# EAGLE design Easy_LED (EAGLE 6.4)
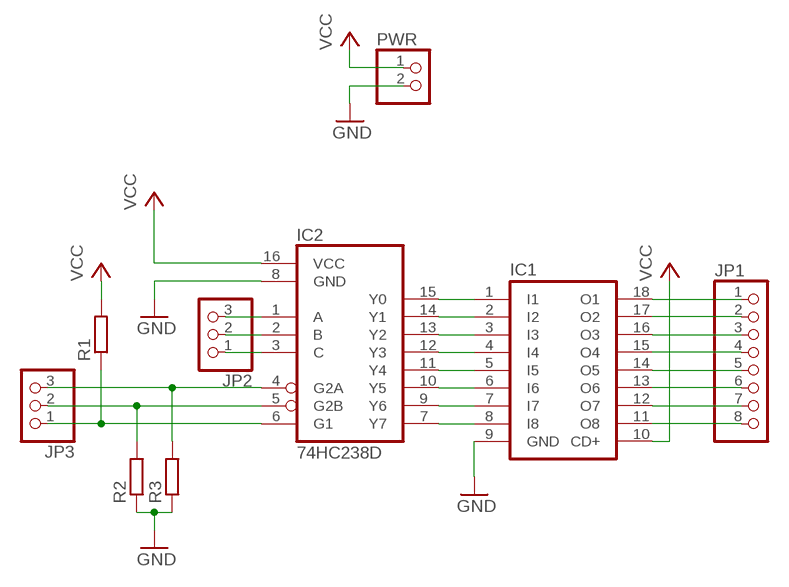
[diagram p0: schematic, sheet 1]

## Parts
IC1  ULN2803ASOP18  [SOP18]
IC2  74HC238D  [SO16]
JP1  PINHD-1X8  [1X08]
JP2  PINHD-1X3  [1X03]
JP3  PINHD-1X3  [1X03]
PWR  PINHD-1X2  [1X02]
R1  R-EU_0207/7  [0207/7]
R2  R-EU_M0805  [M0805]
R3  R-EU_M0805  [M0805]

## Nets
GND: IC1.9(GND) IC2.8(GND) PWR.2 R2.1 R3.1
N$1: IC1.17(O2) JP1.2
N$2: IC1.16(O3) JP1.3
N$3: IC1.15(O4) JP1.4
N$4: IC1.14(O5) JP1.5
N$5: IC1.13(O6) JP1.6
N$6: IC1.12(O7) JP1.7
N$7: IC1.18(O1) JP1.1
N$8: IC1.1(I1) IC2.15(Y0)
N$9: IC1.2(I2) IC2.14(Y1)
N$10: IC1.3(I3) IC2.13(Y2)
N$11: IC1.11(O8) JP1.8
N$15: IC1.4(I4) IC2.12(Y3)
N$16: IC1.5(I5) IC2.11(Y4)
N$17: IC1.6(I6) IC2.10(Y5)
N$22: IC1.7(I7) IC2.9(Y6)
N$23: IC1.8(I8) IC2.7(Y7)
N$24: IC2.1(A) JP2.3
N$29: IC2.2(B) JP2.2
N$30: IC2.3(C) JP2.1
N$31: IC2.4(G2A) JP3.3 R3.2
N$36: IC2.5(G2B) JP3.2 R2.2
N$37: IC2.6(G1) JP3.1 R1.1
VCC: IC1.10(CD+) IC2.16(VCC) PWR.1 R1.2

## Library data of the parts
IC1 = BEEP:ULN2803A: DRIVER ARRAY
IC2 = BEEP:74HC238: 3 to 8 line DECODER/DEMULTIPLEXER
JP1 = pinhead:PINHD-1X8: PIN HEADER
JP2 JP3 = pinhead:PINHD-1X3: PIN HEADER
PWR = pinhead:PINHD-1X2: PIN HEADER
R1-R3 = rcl:R-EU_: RESISTOR, European symbol

## Board
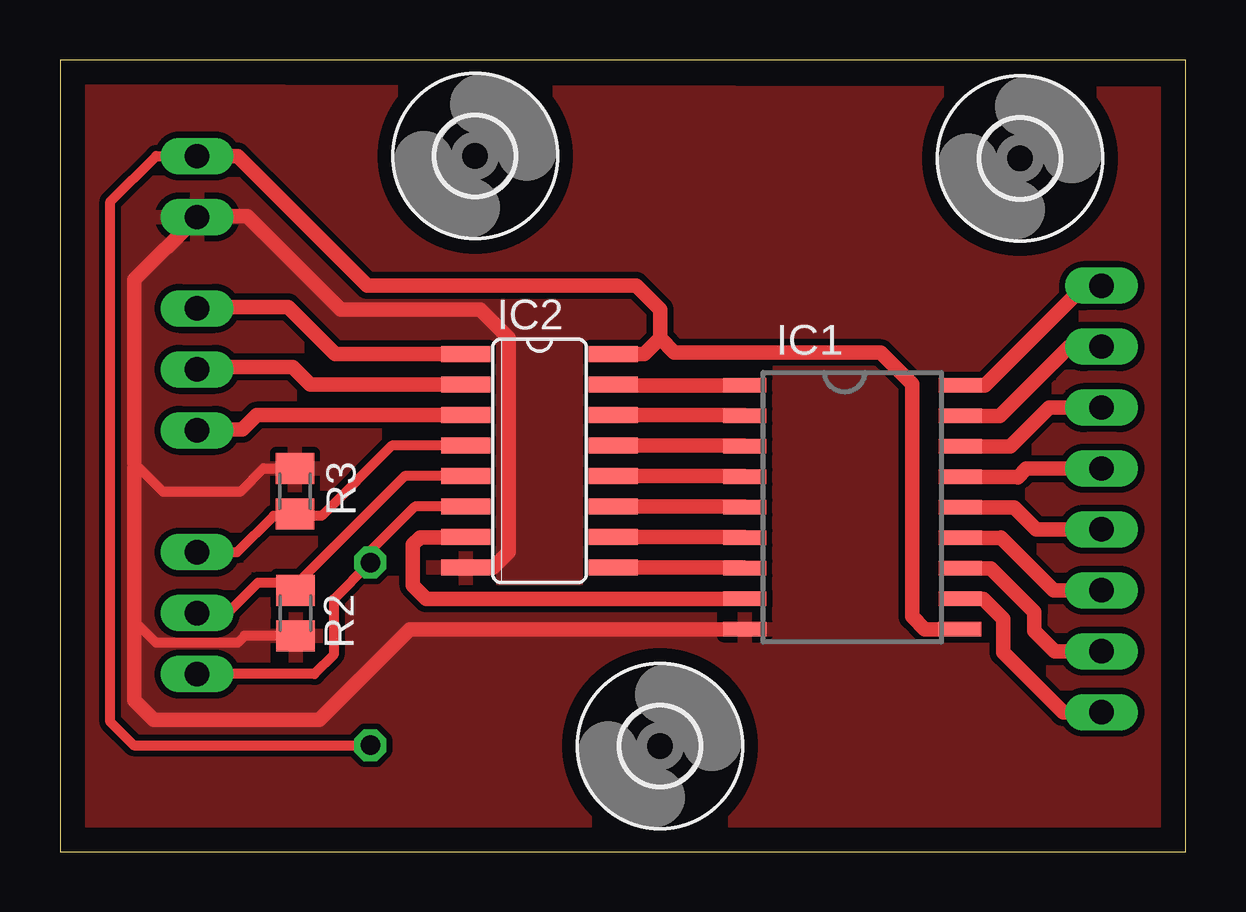
[diagram p1: board, top side]
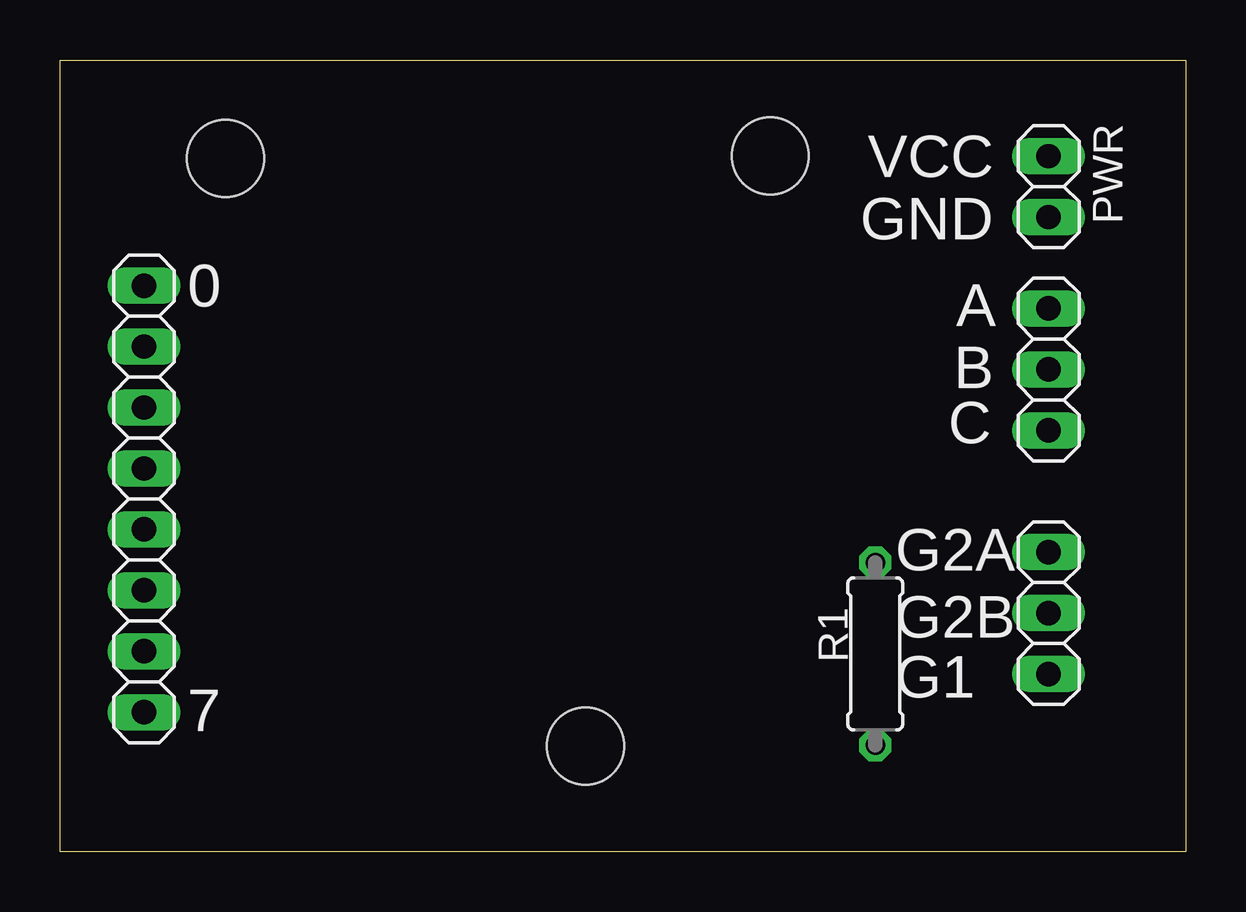
[diagram p2: board, bottom side, seen from below]

Size 46.9 x 33 mm. Coordinates in mm from the lower left corner, seen from the top.
Outline: 0,0 46.9,0 46.9,33 0,33 0,0
Copper layers (1*16): Top 0.035mm / dielectric 1.5mm / Bottom 0.035mm
Design rules "default *": minimum track width 10mil, minimum drill 24mil, track to track 10mil, track to pad 10mil, pad to pad 8mil, via to via 8mil, smd to smd 8mil, copper to edge 40mil, drill to drill 8mil, minimum pad ring 10mil, minimum via ring 8mil, stop-mask expansion 4mil, vias tented up to drill 0mil, thermal gap 10mil

### Footprints (pad centres in the part's own frame; a part is rotated, then mirrored left to right if it is on the bottom)
SOP18 = smd 0.6 x 1.8: 1 -5.08,-4.475; 2 -3.81,-4.475; 3 -2.54,-4.475; 4 -1.27,-4.475; 5 0,-4.475; 6 1.27,-4.475; 7 2.54,-4.475; 8 3.81,-4.475; 9 5.08,-4.475; 10 5.08,4.475; 11 3.81,4.5; 12 2.54,4.5; 13 1.27,4.5; 14 0,4.5; 15 -1.27,4.5; 16 -2.54,4.5; 17 -3.81,4.5; 18 -5.08,4.5
SO16 = smd 0.66 x 2.032: 1 -4.445,-3.073; 2 -3.175,-3.073; 3 -1.905,-3.073; 4 -0.635,-3.073; 5 0.635,-3.073; 6 1.905,-3.073; 7 3.175,-3.073; 8 4.445,-3.073; 9 4.445,3.073; 10 3.175,3.073; 11 1.905,3.073; 12 0.635,3.073; 13 -0.635,3.073; 14 -1.905,3.073; 15 -3.175,3.073; 16 -4.445,3.073
1X08 = drill 1.016 long: 1 -8.89,0; 2 -6.35,0; 3 -3.81,0; 4 -1.27,0; 5 1.27,0; 6 3.81,0; 7 6.35,0; 8 8.89,0
1X03 = drill 1.016 long: 1 -2.54,0; 2 0,0; 3 2.54,0
1X02 = drill 1.016 long: 1 -1.27,0; 2 1.27,0
0207/7 = drill 0.813 octagon: 1 -3.81,0; 2 3.81,0
M0805 = smd 1.3 x 1.6: 1 -0.95,0; 2 0.95,0
3,2 = hole 3.2: 0,0

### Placement (x,y rotation side)
IC1  33.01,14.35 270 top
IC2  19.98,16.29 270 top
JP1  43.4,14.7 270 bottom
JP2  5.71,20.1 90 bottom
JP3  5.71,9.94 90 bottom
PWR  5.71,27.72 270 bottom
R1  12.93,8.24 270 bottom
R2  9.82,9.94 90 top
R3  9.79,15.02 270 top
U$1  [3,2]  25,4.4 0 top
U$2  [3,2]  40,28.9 0 top
U$3  [3,2]  17.3,29 0 top

### Tracks (layer width: path | path; a pad name or v marks a point on that pad's centre or on a via)
GND
  Top 0.406: R2.1 7.69,8.99 7.4,8.7 4,8.7 3.1,9.6 3.1,16 3.1,16.2 4.3,15 7.5,15 8.47,15.97 R3.1
  Top 0.61: IC2.8 18.05,11.85 18.7,12.5 18.7,21.4 17.5,22.6 11.7,22.6 7.8,26.5 5.76,26.5 PWR.2 3.1,23.84 3.1,16.2 | IC1.9 14.57,9.27 10.8,5.5 3.9,5.5 3.1,6.3 3.1,16
  pour Top: 0,31.7 46.9,31.6 46.9,0 0,0.1
N$1
  Top 0.61: IC1.17 39.16,18.16 42.05,21.05 JP1.2
N$2
  Top 0.61: IC1.16 39.59,16.89 41.21,18.51 JP1.3
N$3
  Top 0.61: IC1.15 39.88,15.62 39.9,15.6 40.27,15.97 JP1.4
N$4
  Top 0.61: IC1.14 39.75,14.35 40.67,13.43 JP1.5
N$5
  Top 0.61: IC1.13 39.18,13.08 39.2,13.1 41.41,10.89 JP1.6
N$6
  Top 0.61: IC1.12 38.79,11.81 40.6,10 40.6,9.2 41.45,8.35 JP1.7
N$7
  Top 0.61: IC1.18 38.53,19.43 42.69,23.59 JP1.1
N$8
  Top 0.61: IC1.1 22.79,19.43 IC2.15
N$9
  Top 0.61: IC2.14 28.5,18.2 IC1.2
N$10
  Top 0.61: IC2.13 28.5,16.93 IC1.3
N$11
  Top 0.61: IC1.11 38.46,10.54 39.3,9.7 39.3,8.3 41.8,5.8 JP1.8
N$15
  Top 0.61: IC2.12 28.5,15.65 IC1.4
N$16
  Top 0.61: IC2.11 28.5,14.38 IC1.5
N$17
  Top 0.61: IC2.10 28.5,13.12 IC1.6
N$22
  Top 0.61: IC2.9 28.5,11.85 IC1.7
N$23
  Top 0.61: IC1.8 15.26,10.54 14.7,11.1 14.7,12.8 15,13.1 16.59,13.1 IC2.7
N$24
  Top 0.61: IC2.1 11.46,20.73 9.5,22.7 5.77,22.7 JP2.3
N$29
  Top 0.61: IC2.2 10.44,19.46 9.7,20.2 5.81,20.2 JP2.2
N$30
  Top 0.61: IC2.3 8.2,18.2 7.6,17.6 5.75,17.6 JP2.1
N$31
  Top 0.406: IC2.4 13.82,16.93 10.9,14 9.86,14 | JP3.3 7.38,12.48 8.9,14 9.72,14
  Top 0.61: 9.72,14 R3.2 9.86,14
N$36
  Top 0.406: JP3.2 6.98,9.94 8.25,11.21 9.2,11.21 R2.2 | IC2.5 14.36,15.65 9.9,11.2
  Top 0.61: 9.9,11.2 9.83,11.2 R2.2
N$37
  Top 0.406: IC2.6 14.79,14.38 12.93,12.53 R1.1 11.4,10.52 11.4,8.2 10.6,7.4 JP3.1
VCC
  Top 0.406: PWR.1 4,29 2.1,27.1 2.1,5.4 3.07,4.43 R1.2
  Top 0.61: IC2.16 24.34,20.73 25,21.4 | 25,21.4 25,22.6 24,23.6 12.8,23.6 7.4,29 PWR.1 | IC1.10 36.03,9.27 35.5,9.8 35.5,19.5 34.2,20.8 25.6,20.8 25,21.4

### Text on the board
bPlace: VCC | GND | 0 | A | B | C | G2A | G2B | G1 | 7